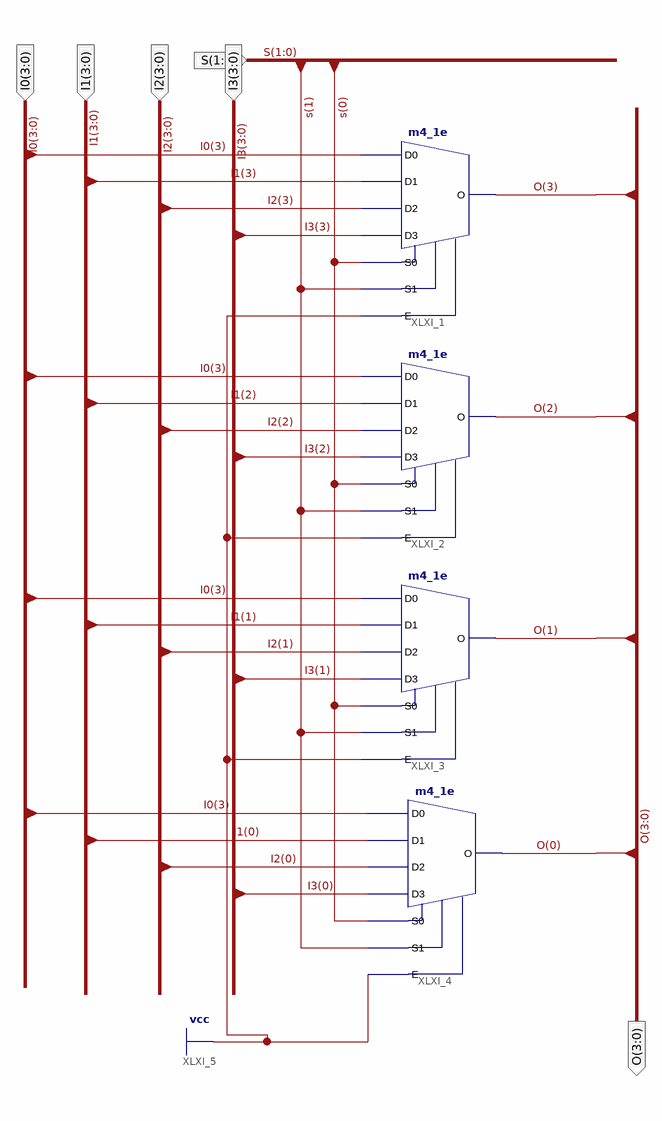
[diagram p0: schematic sheet 1]
// Xilinx ISE schematic Mux4x4.sch (spartan3e) as structural Verilog: 4 symbols, 6 ports
module Mux4x4 (
  input  [1:0] S,
  input  [3:0] I0,
  input  [3:0] I1,
  input  [3:0] I2,
  input  [3:0] I3,
  output [3:0] O
);

  m4_1e XLXI_1 (.D0(I0[3]), .D1(I1[3]), .D2(I2[3]), .D3(I3[3]), .E(1'b1), .S0(S[0]), .S1(S[1]), .O(O[3]));
  m4_1e XLXI_2 (.D0(I0[3]), .D1(I1[2]), .D2(I2[2]), .D3(I3[2]), .E(1'b1), .S0(S[0]), .S1(S[1]), .O(O[2]));
  m4_1e XLXI_3 (.D0(I0[3]), .D1(I1[1]), .D2(I2[1]), .D3(I3[1]), .E(1'b1), .S0(S[0]), .S1(S[1]), .O(O[1]));
  m4_1e XLXI_4 (.D0(I0[3]), .D1(I1[0]), .D2(I2[0]), .D3(I3[0]), .E(1'b1), .S0(S[0]), .S1(S[1]), .O(O[0]));
endmodule
